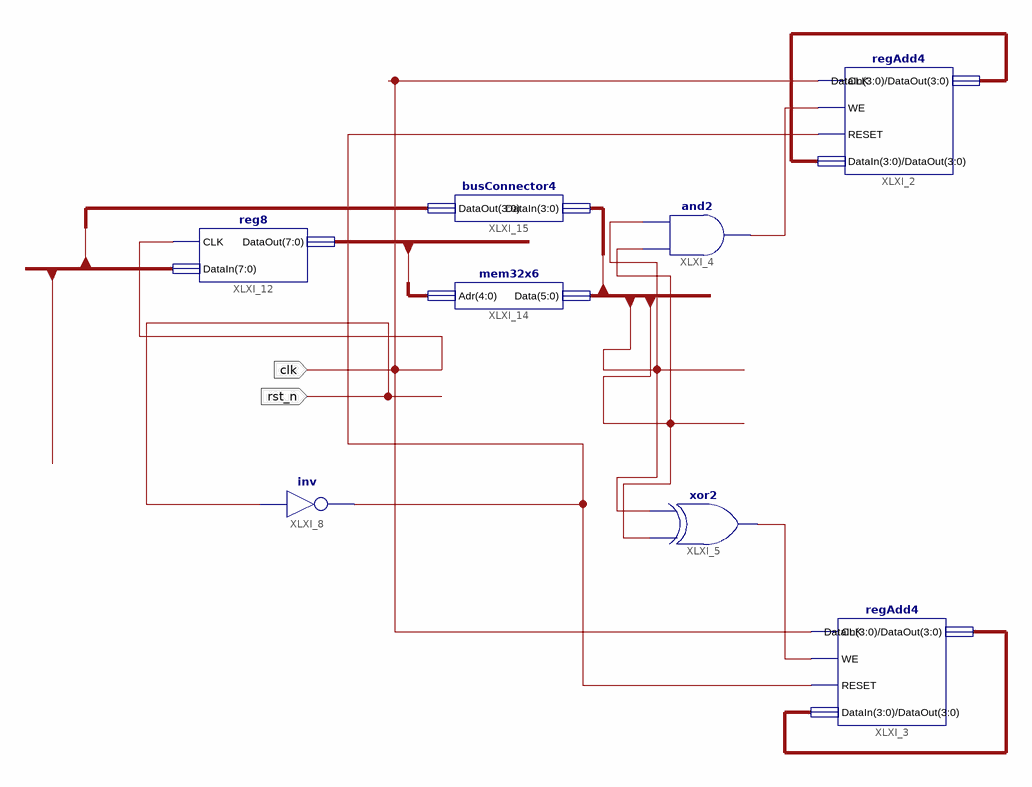
[diagram p0: schematic sheet 1]
// Xilinx ISE schematic BCD_check_register.sch (spartan3e) as structural Verilog: 8 symbols, 2 ports
module BCD_check_register (
  input  clk,
  input  rst_n
);

  wire XLXN_10, XLXN_11, XLXN_30;
  wire [3:0] InvalidCounter, ValidCounter;
  wire [5:0] Mem_Data;
  wire [7:0] Eingang, XLXN_47;

  regAdd4 XLXI_2 (.CLK(clk), .WE(XLXN_10), .RESET(XLXN_30), .DataIn(ValidCounter), .DataOut(ValidCounter));
  regAdd4 XLXI_3 (.CLK(clk), .WE(XLXN_11), .RESET(XLXN_30), .DataIn(InvalidCounter), .DataOut(InvalidCounter));
  and XLXI_4 (XLXN_10, Mem_Data[0], Mem_Data[1]);
  xor XLXI_5 (XLXN_11, Mem_Data[0], Mem_Data[1]);
  not XLXI_8 (XLXN_30, rst_n);
  reg8 XLXI_12 (.CLK(clk), .DataIn(Eingang), .DataOut(XLXN_47));
  mem32x6 XLXI_14 (.Adr(XLXN_47[4:0]), .Data(Mem_Data));
  busConnector4 XLXI_15 (.DataIn(Mem_Data[5:2]), .DataOut(Eingang[4:1]));
endmodule
